# EAGLE design adapters (EAGLE 9.6.2)
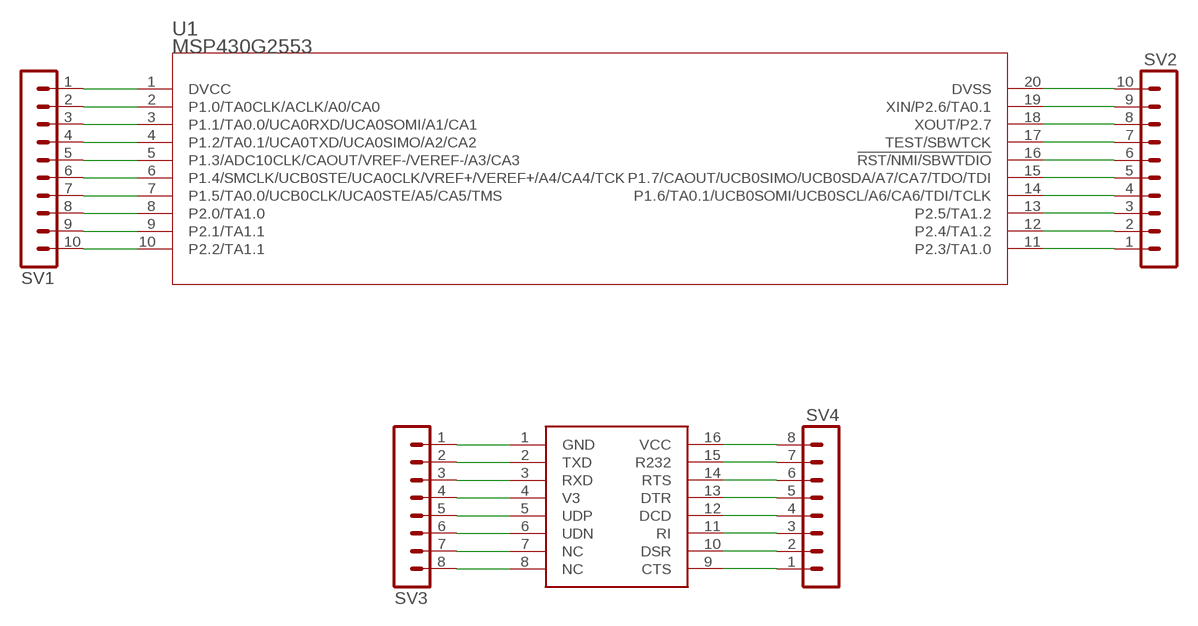
[diagram p0: schematic, sheet 1]

## Parts
SV1  MA10-1  [MA10-1]
SV2  MA10-1  [MA10-1]
SV3  MA08-1  [MA08-1]
SV4  MA08-1  [MA08-1]
U1  MSP430G2553  MSP430G2553IPW20RPW20-M  [PW20-M]
U$1  CH340  [SOP16]

## Nets
N$1: SV1.1 U1.1(DVCC)
N$2: SV1.2 U1.2(P1.0/TA0CLK/ACLK/A0/CA0)
N$3: SV1.3 U1.3(P1.1/TA0.0/UCA0RXD/UCA0SOMI/A1/CA1)
N$4: SV1.4 U1.4(P1.2/TA0.1/UCA0TXD/UCA0SIMO/A2/CA2)
N$5: SV1.5 U1.5(P1.3/ADC10CLK/CAOUT/VREF-/VEREF-/A3/CA3)
N$6: SV1.6 U1.6(P1.4/SMCLK/UCB0STE/UCA0CLK/VREF+/VEREF+/A4/CA4/TCK)
N$7: SV1.7 U1.7(P1.5/TA0.0/UCB0CLK/UCA0STE/A5/CA5/TMS)
N$8: SV1.8 U1.8(P2.0/TA1.0)
N$9: SV1.9 U1.9(P2.1/TA1.1)
N$10: SV1.10 U1.10(P2.2/TA1.1)
N$11: SV2.1 U1.11(P2.3/TA1.0)
N$12: SV2.2 U1.12(P2.4/TA1.2)
N$13: SV2.3 U1.13(P2.5/TA1.2)
N$14: SV2.4 U1.14(P1.6/TA0.1/UCB0SOMI/UCB0SCL/A6/CA6/TDI/TCLK)
N$15: SV2.5 U1.15(P1.7/CAOUT/UCB0SIMO/UCB0SDA/A7/CA7/TDO/TDI)
N$16: SV2.6 U1.16(!RST/NMI/SBWTDIO)
N$17: SV2.7 U1.17(TEST/SBWTCK)
N$18: SV2.8 U1.18(XOUT/P2.7)
N$19: SV2.9 U1.19(XIN/P2.6/TA0.1)
N$20: SV2.10 U1.20(DVSS)
N$21: SV3.1 U$1.1(GND)
N$22: SV3.2 U$1.2(TXD)
N$23: SV3.3 U$1.3(RXD)
N$24: SV3.4 U$1.4(V3)
N$25: SV3.5 U$1.5(UDP)
N$26: SV3.6 U$1.6(UDN)
N$27: SV3.7 U$1.7(NC)
N$28: SV3.8 U$1.8(NC)
N$29: SV4.1 U$1.9(CTS)
N$30: SV4.2 U$1.10(DSR)
N$31: SV4.3 U$1.11(RI)
N$32: SV4.4 U$1.12(DCD)
N$33: SV4.5 U$1.13(DTR)
N$34: SV4.6 U$1.14(RTS)
N$35: SV4.7 U$1.15(R232)
N$36: SV4.8 U$1.16(VCC)

## Library data of the parts
SV1 SV2 = con-lstb:MA10-1: PIN HEADER; OC_FARNELL: unknown; OC_NEWARK: unknown
SV3 SV4 = con-lstb:MA08-1: PIN HEADER; OC_FARNELL: unknown; OC_NEWARK: unknown
U1 = msp430g2553_tssop20:MSP430G2553IPW20R; COPYRIGHT: Copyright (C) 2023 Ultra Librarian. All rights reserved.; MANUFACTURER_PART_NUMBER: MSP430G2553IPW20R; MFR_NAME: Texas Instruments
U$1 = ch340:CH340

## Board
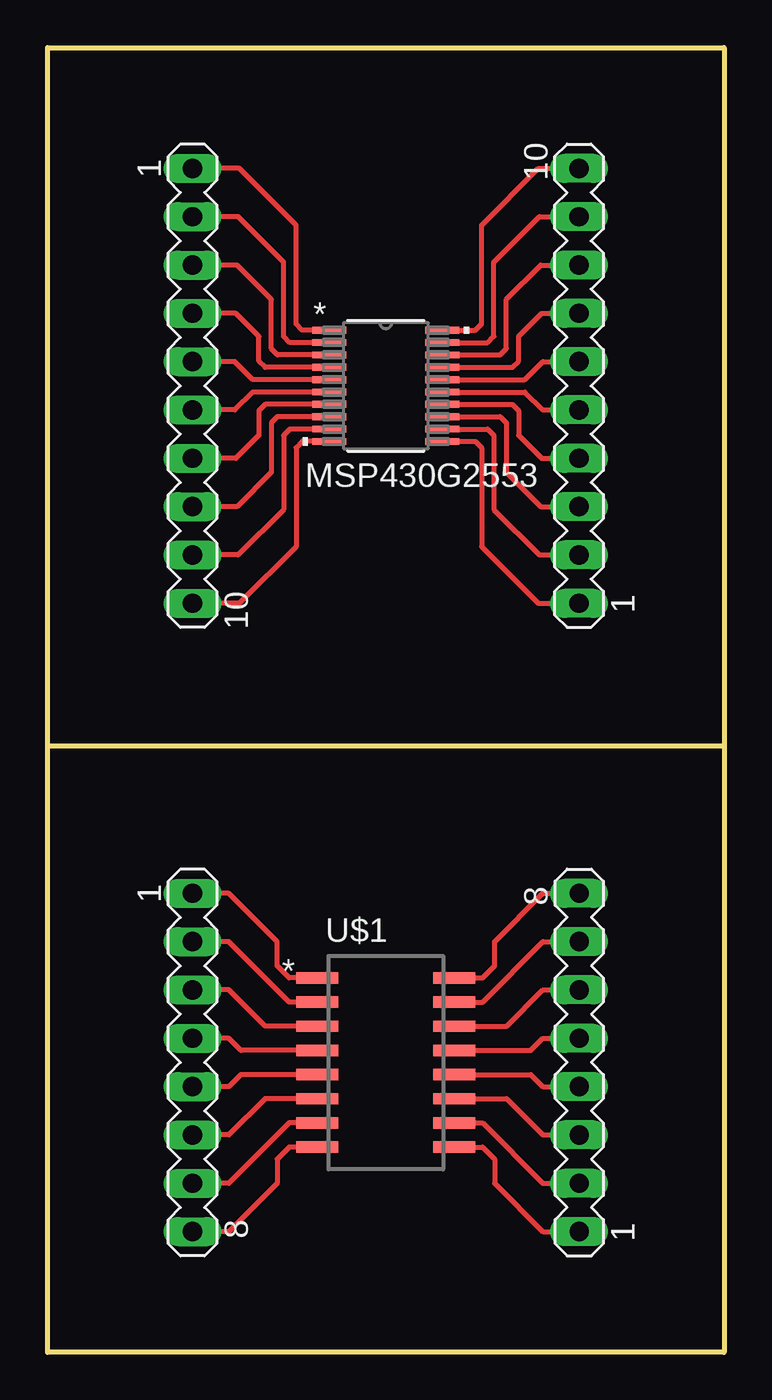
[diagram p1: board, top side]

Size 35.56 x 68.58 mm. Coordinates in mm from the lower left corner, seen from the top.
Outline: 0,31.88 0,0 35.56,0 35.56,31.88
Outline: 0,31.88 0,68.58 35.56,68.58 35.56,31.88
Outline: 0,31.88 35.56,31.88
Copper layers (1*16): Top 0.035mm / dielectric 1.5mm / Bottom 0.035mm
Design rules "default": minimum track width 6mil, minimum drill 0.35mm, track to track 6mil, track to pad 6mil, pad to pad 6mil, via to via 6mil, smd to smd 6mil, copper to edge 40mil, drill to drill 6mil, minimum pad ring 10mil, minimum via ring 8mil, stop-mask expansion 4mil, vias tented up to drill 0mil, thermal gap 10mil

### Footprints (pad centres in the part's own frame; a part is rotated, then mirrored left to right if it is on the bottom)
MA10-1 = drill 1.016 long: 1 -11.43,0; 2 -8.89,0; 3 -6.35,0; 4 -3.81,0; 5 -1.27,0; 6 1.27,0; 7 3.81,0; 8 6.35,0; 9 8.89,0; 10 11.43,0
MA08-1 = drill 1.016 long: 1 -8.89,0; 2 -6.35,0; 3 -3.81,0; 4 -1.27,0; 5 1.27,0; 6 3.81,0; 7 6.35,0; 8 8.89,0
PW20-M = smd 1.778 x 0.356: 1 -2.972,2.925; 2 -2.972,2.275; 3 -2.972,1.625; 4 -2.972,0.975; 5 -2.972,0.325; 6 -2.972,-0.325; 7 -2.972,-0.975; 8 -2.972,-1.625; 9 -2.972,-2.275; 10 -2.972,-2.925; 11 2.972,-2.925; 12 2.972,-2.275; 13 2.972,-1.625; 14 2.972,-0.975; 15 2.972,-0.325; 16 2.972,0.325; 17 2.972,0.975; 18 2.972,1.625; 19 2.972,2.275; 20 2.972,2.925
SOP16 = smd 2.2 x 0.6: 1 -3.6,4.445; 2 -3.6,3.175; 3 -3.6,1.905; 4 -3.6,0.635; 5 -3.6,-0.635; 6 -3.6,-1.905; 7 -3.6,-3.175; 8 -3.6,-4.445; 9 3.6,-4.445; 10 3.6,-3.175; 11 3.6,-1.905; 12 3.6,-0.635; 13 3.6,0.635; 14 3.6,1.905; 15 3.6,3.175; 16 3.6,4.445

### Placement (x,y rotation side)
SV1  7.62,50.8 270 top
SV2  27.94,50.8 90 top
SV3  7.62,15.24 270 top
SV4  27.94,15.24 90 top
U1  17.78,50.8 0 top
U$1  17.78,15.24 0 top

### Tracks (layer width: path | path; a pad name or v marks a point on that pad's centre or on a via)
N$1
  Top 0.254: U1.1 13.38,53.73 13.06,54.05 13.06,59.25 10.08,62.23 SV1.1
N$2
  Top 0.254: U1.2 12.73,53.08 12.41,53.4 12.41,57.3 10.02,59.69 SV1.2
N$3
  Top 0.254: U1.3 12.08,52.43 11.76,52.75 11.76,55.35 9.96,57.15 SV1.3
N$4
  Top 0.254: U1.4 11.43,51.78 11.11,52.1 11.11,53.4 9.9,54.61 SV1.4
N$5
  Top 0.254: U1.5 10.78,51.13 9.84,52.07 SV1.5
N$6
  Top 0.254: U1.6 10.78,50.48 9.84,49.53 SV1.6
N$7
  Top 0.254: U1.7 11.43,49.83 11.11,49.5 11.11,48.2 9.9,46.99 SV1.7
N$8
  Top 0.254: U1.8 12.08,49.18 11.76,48.85 11.76,46.25 9.96,44.45 SV1.8
N$9
  Top 0.254: U1.9 12.73,48.53 12.41,48.2 12.41,44.3 10.02,41.91 SV1.9
N$10
  Top 0.254: U1.10 13.38,47.88 13.06,47.55 13.06,42.35 10.08,39.37 SV1.10
N$11
  Top 0.254: U1.11 22.48,47.88 22.81,47.55 22.81,42.35 25.79,39.37 SV2.1
N$12
  Top 0.254: U1.12 23.13,48.53 23.46,48.2 23.46,44.3 25.85,41.91 SV2.2
N$13
  Top 0.254: U1.13 23.78,49.18 24.11,48.85 24.11,46.25 25.91,44.45 SV2.3
N$14
  Top 0.254: U1.14 24.43,49.83 24.76,49.5 24.76,48.2 25.97,46.99 SV2.4
N$15
  Top 0.254: U1.15 25.08,50.48 26.03,49.53 SV2.5
N$16
  Top 0.254: U1.16 25.08,51.13 26.03,52.07 SV2.6
N$17
  Top 0.254: U1.17 24.43,51.78 24.76,52.1 24.76,53.4 25.97,54.61 SV2.7
N$18
  Top 0.254: U1.18 23.78,52.43 24.11,52.75 24.11,55.35 25.91,57.15 SV2.8
N$19
  Top 0.254: U1.19 23.13,53.08 23.46,53.4 23.46,57.3 25.85,59.69 SV2.9
N$20
  Top 0.254: U1.20 22.48,53.73 22.81,54.05 22.81,59.25 25.79,62.23 SV2.10
N$21
  Top 0.254: U$1.1 12.7,19.68 12.06,20.32 12.06,21.59 9.53,24.13 SV3.1
N$22
  Top 0.254: U$1.2 12.7,18.41 9.53,21.59 SV3.2
N$23
  Top 0.254: U$1.3 11.43,17.14 9.53,19.05 SV3.3
N$24
  Top 0.254: U$1.4 10.16,15.88 9.53,16.51 SV3.4
N$25
  Top 0.254: U$1.5 10.16,14.61 9.53,13.97 SV3.5
N$26
  Top 0.254: U$1.6 11.43,13.34 9.53,11.43 SV3.6
N$27
  Top 0.254: U$1.7 12.7,12.06 9.53,8.89 SV3.7
N$28
  Top 0.254: U$1.8 12.7,10.79 12.06,10.16 12.06,8.89 9.53,6.35 SV3.8
N$29
  Top 0.254: U$1.9 22.86,10.79 23.5,10.16 23.5,8.89 26.04,6.35 SV4.1
N$30
  Top 0.254: U$1.10 22.86,12.06 26.04,8.89 SV4.2
N$31
  Top 0.254: U$1.11 24.13,13.34 26.04,11.43 SV4.3
N$32
  Top 0.254: U$1.12 25.4,14.61 26.04,13.97 SV4.4
N$33
  Top 0.254: U$1.13 25.4,15.88 26.04,16.51 SV4.5
N$34
  Top 0.254: U$1.14 24.13,17.14 26.04,19.05 SV4.6
N$35
  Top 0.254: U$1.15 22.86,18.41 26.04,21.59 SV4.7
N$36
  Top 0.254: U$1.16 22.86,19.68 23.5,20.32 23.5,21.59 26.04,24.13 SV4.8